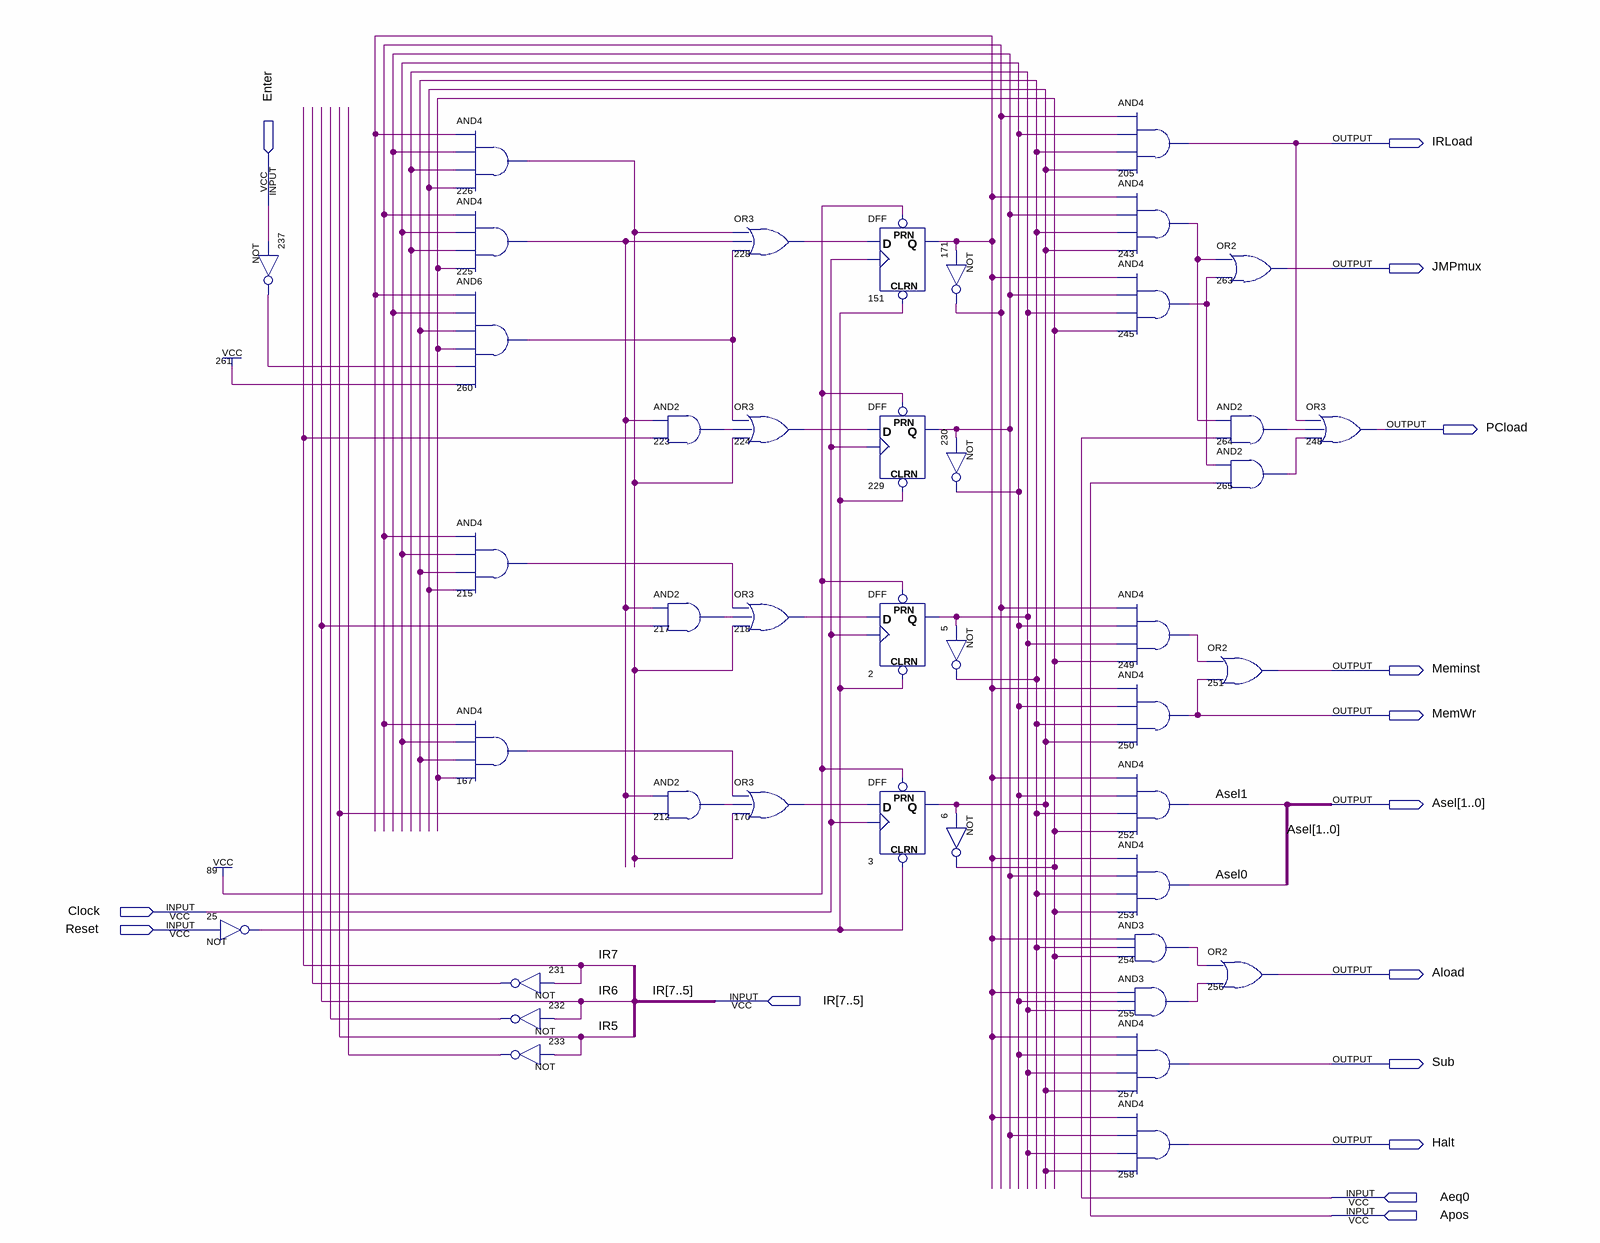
[diagram p0: schematic sheet]
// Quartus schematic cu.bdf as structural Verilog: 42 symbols, 15 pins
module cu (
  input  Enter,
  input  Clock,
  input  Reset,
  input  [7:5] IR,
  input  Aeq0,
  input  Apos,
  output IRLoad,
  output JMPmux,
  output PCload,
  output Meminst,
  output MemWr,
  output [1:0] Asel,
  output Aload,
  output Sub,
  output Halt
);

  wire n2_q, n3_q, n5_out, n6_out, n25_out, n151_q, n167_out, n170_out, n171_out, n212_out, n215_out,
       n217_out, n218_out, n223_out, n224_out, n225_out, n226_out, n228_out, n229_q, n230_out, n231_out,
       n232_out, n233_out, n237_out, n243_out, n245_out, n249_out, n254_out, n255_out, n260_out, n264_out,
       n265_out;

  not u_25 (n25_out, Reset);
  not u_237 (n237_out, Enter);
  and u_226 (n226_out, n151_q, n229_q, n2_q, n3_q);
  and u_225 (n225_out, n171_out, n230_out, n2_q, n6_out);
  and u_260 (n260_out, n151_q, n229_q, n5_out, n6_out, n237_out, 1'b1);
  and u_215 (n215_out, n171_out, n230_out, n5_out, n3_q);
  and u_167 (n167_out, n171_out, n230_out, n5_out, n6_out);
  not u_231 (n231_out, IR[7]);
  not u_232 (n232_out, IR[6]);
  not u_233 (n233_out, IR[5]);
  and u_223 (n223_out, n225_out, IR[7]);
  and u_217 (n217_out, n225_out, IR[6]);
  and u_212 (n212_out, n225_out, IR[5]);
  or u_228 (n228_out, n226_out, n225_out, n260_out);
  or u_224 (n224_out, n260_out, n223_out, n226_out);
  or u_218 (n218_out, n215_out, n217_out, n226_out);
  or u_170 (n170_out, n167_out, n212_out, n226_out);
  DFF u_151 (.CLRN(n25_out), .CLK(Clock), .D(n228_out), .PRN(1'b1), .Q(n151_q));
  DFF u_229 (.CLRN(n25_out), .CLK(Clock), .D(n224_out), .PRN(1'b1), .Q(n229_q));
  DFF u_2 (.CLRN(n25_out), .CLK(Clock), .D(n218_out), .PRN(1'b1), .Q(n2_q));
  DFF u_3 (.CLRN(n25_out), .CLK(Clock), .D(n170_out), .PRN(1'b1), .Q(n3_q));
  not u_171 (n171_out, n151_q);
  not u_230 (n230_out, n229_q);
  not u_5 (n5_out, n2_q);
  not u_6 (n6_out, n3_q);
  and u_205 (IRLoad, n171_out, n230_out, n5_out, n3_q);
  and u_243 (n243_out, n151_q, n229_q, n5_out, n3_q);
  and u_245 (n245_out, n151_q, n229_q, n2_q, n6_out);
  and u_249 (n249_out, n171_out, n230_out, n2_q, n6_out);
  and u_250 (MemWr, n151_q, n230_out, n5_out, n3_q);
  and u_252 (Asel[1], n151_q, n230_out, n5_out, n6_out);
  and u_253 (Asel[0], n151_q, n229_q, n5_out, n6_out);
  and u_254 (n254_out, n151_q, n5_out, n6_out);
  and u_255 (n255_out, n151_q, n230_out, n2_q);
  and u_257 (Sub, n151_q, n230_out, n2_q, n3_q);
  and u_258 (Halt, n151_q, n229_q, n2_q, n3_q);
  or u_263 (JMPmux, n243_out, n245_out);
  and u_264 (n264_out, n243_out, Aeq0);
  and u_265 (n265_out, n245_out, Apos);
  or u_251 (Meminst, n249_out, MemWr);
  or u_256 (Aload, n254_out, n255_out);
  or u_248 (PCload, IRLoad, n264_out, n265_out);
endmodule
